# Altium schematic sheet Sheet_1_2026-10-05.schdoc
size 201 x 121 mm
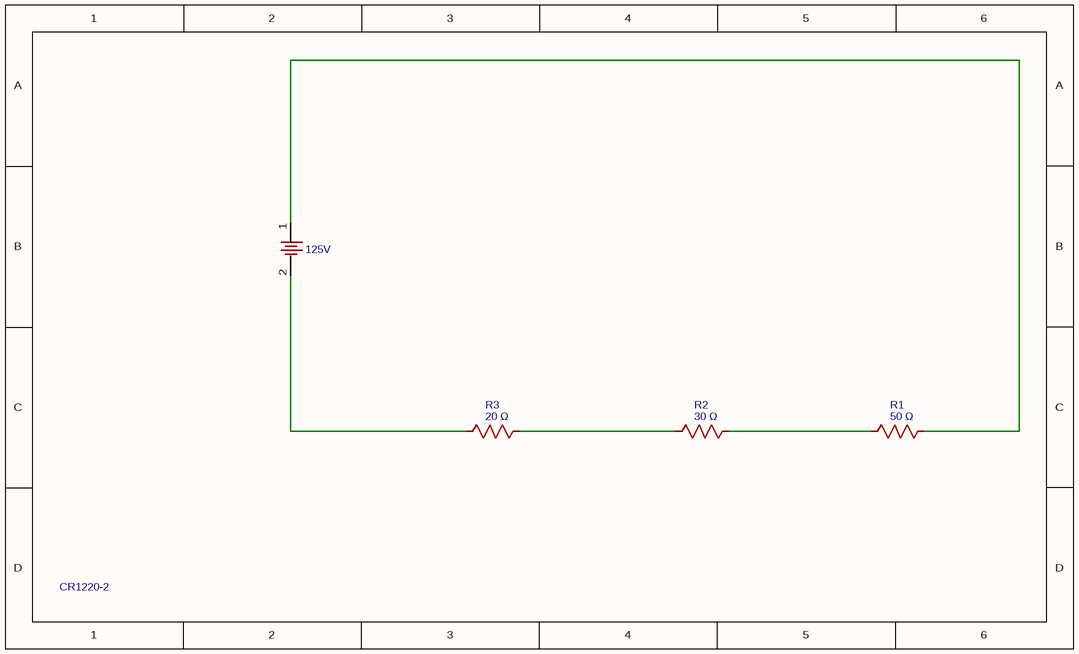
[diagram p0: Sheet_1_2026-10-05.schdoc]

## Parts
125V  CR1220-2  [BAT-SMD_CR1220-2]
R1  50 Ω  [R0603]
R2  30 Ω  [R0603]
R3  20 Ω  [R0603]

## Nets
Net125V_1: 125V.1 R1.2
Net125V_2: 125V.2 R3.1
NetR1_1: R1.1 R2.2
NetR2_1: R2.1 R3.2

## Library data of the parts
125V = CR1220-2: Manufacturer: Q&J; Supplier: LCSC; Manufacturer Part: CR1220-2; image: //image.lceda.cn/szlcsc/C70381.jpg; Supplier Part: C70381; spicePre: B; spiceSymbolName: CR1220-2
R1 = 50 Ω: nameAlias: Value(Ω); Contributor: LCEDA_Lib; spicePre: R; spiceSymbolName: R_0603_US
R2 = 30 Ω: nameAlias: Value(Ω); Contributor: LCEDA_Lib; spicePre: R; spiceSymbolName: R_0603_US
R3 = 20 Ω: nameAlias: Value(Ω); Contributor: LCEDA_Lib; spicePre: R; spiceSymbolName: R_0603_US